# EAGLE design rev_c (EAGLE 9.6.2)
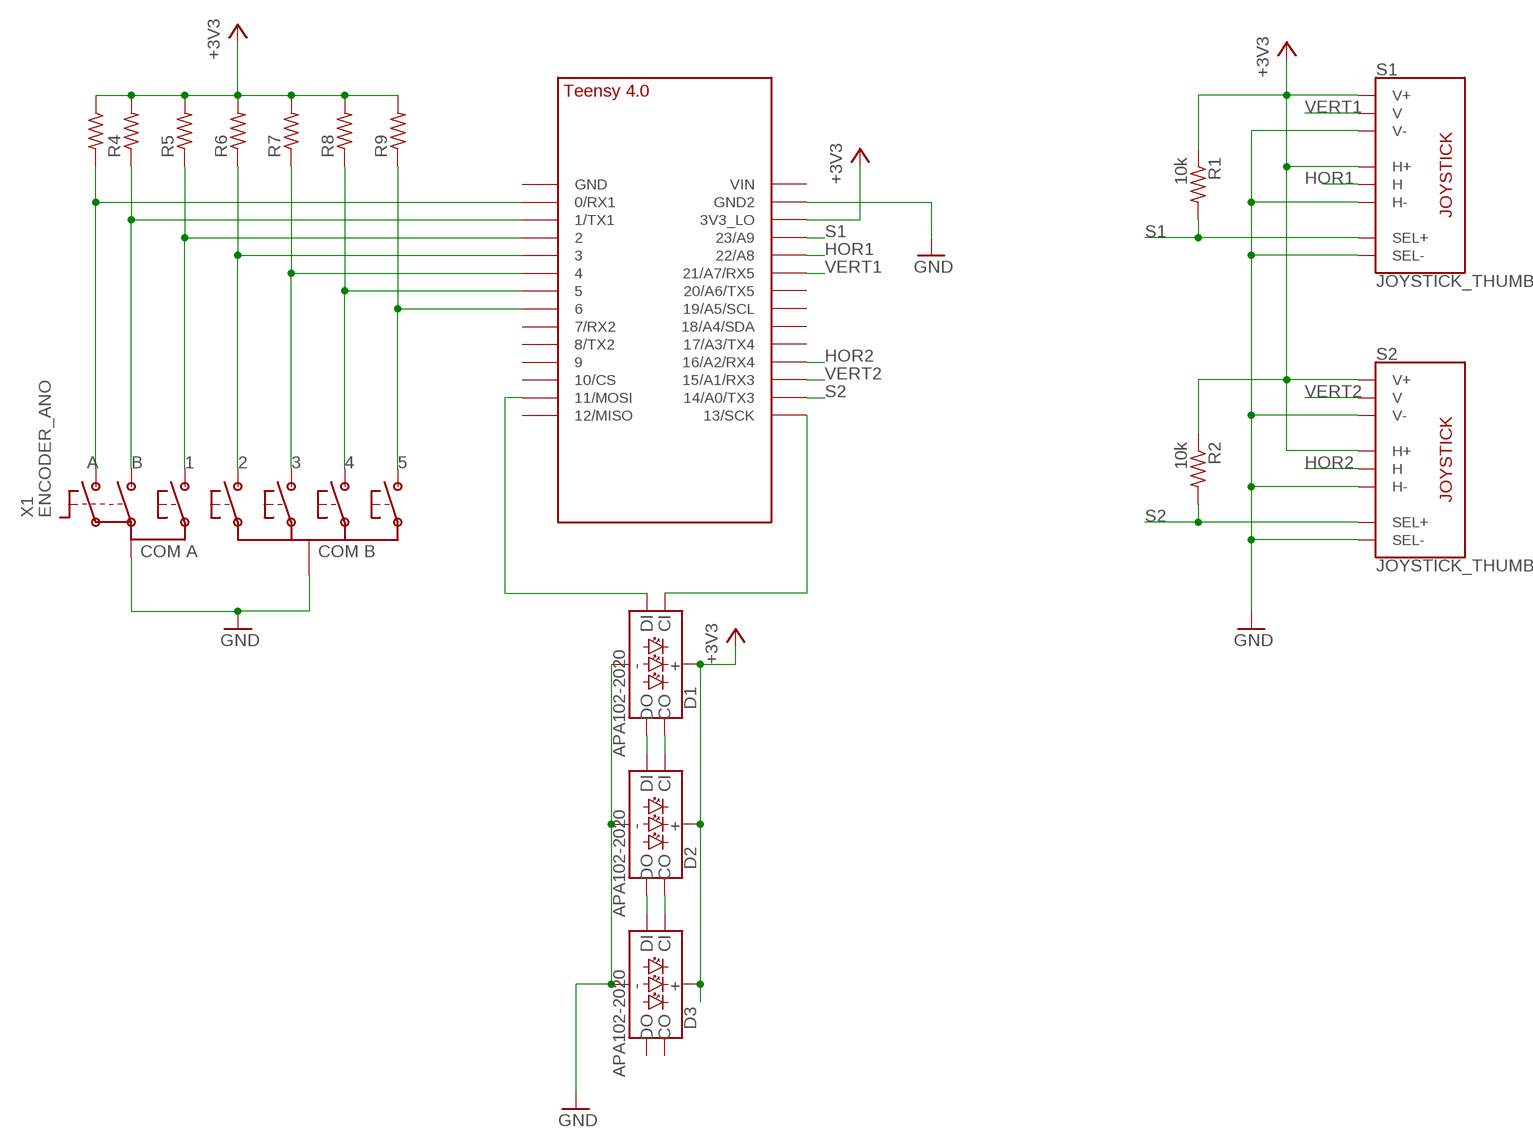
[diagram p0: schematic, sheet 1]

## Parts
D1  APA102-2020  [APA102-2020]
D2  APA102-2020  [APA102-2020]
D3  APA102-2020  [APA102-2020]
MCU  TEENSY_4.0-NOBOTTOM  [TEENSY_4.0-NOBOTTOM]
R1  10k  R-US_R0603  [R0603]
R2  10k  R-US_R0603  [R0603]
R3  10k  R-US_R0603  [R0603]
R4  R-US_R0603  [R0603]
R5  R-US_R0603  [R0603]
R6  R-US_R0603  [R0603]
R7  R-US_R0603  [R0603]
R8  R-US_R0603  [R0603]
R9  R-US_R0603  [R0603]
S1  JOYSTICK_THUMB  [JOYSTICK]
S2  JOYSTICK_THUMB  [JOYSTICK]
X1  ENCODER_ANO  [ENCODER_ANO]

## Nets
+3V3: D1.VDD(VCC) D2.VDD(VCC) D3.VDD(VCC) MCU.3V3_LO R1.1 R2.1 R3.1 R4.2 R5.2 R6.2 R7.2 R8.2 R9.2 S1.H1(H+) S1.V1(V+) S2.H1(H+) S2.V1(V+)
GND: D1.GND D2.GND D3.GND MCU.GND2 S1.B2A(SEL-) S1.H3(H-) S1.V3(V-) S2.B2A(SEL-) S2.H3(H-) S2.V3(V-) X1.COM_A(COMA) X1.COM_B
HOR1: MCU.22/A8 S1.H2(H)
HOR2: MCU.16/A2(16/A2/RX4) S2.H2(H)
N$1: MCU.6 R9.1 X1.S5
N$2: MCU.5 R8.1 X1.S4
N$3: MCU.4/CANRX R7.1 X1.S3
N$4: MCU.3/CANTX R6.1 X1.S2
N$5: MCU.2 R5.1 X1.S1
N$6: MCU.1/TX(1/TX1) R4.1 X1.B
N$7: MCU.0/RX(0/RX1) R3.2 X1.A
N$8: D1.SDO(DO) D2.SDI(DI)
N$9: D1.CKO(CO) D2.CKI(CI)
N$10: D2.SDO(DO) D3.SDI(DI)
N$11: D2.CKO(CO) D3.CKI(CI)
N$12: D1.CKI(CI) MCU.13/SCK
N$13: D1.SDI(DI) MCU.11/MOSI
S1: MCU.23/A9 R1.2 S1.B1A(SEL+)
S2: MCU.14/A0(14/A0/TX3) R2.2 S2.B1A(SEL+)
VERT1: MCU.21/A7(21/A7/RX5) S1.V2(V)
VERT2: MCU.15/A1(15/A1/RX3) S2.V2(V)
Unconnected: D3.CKO(CO) D3.SDO(DO) MCU.7(7/RX2) MCU.8(8/TX2) MCU.9/CS MCU.10/CS MCU.12/MISO MCU.17/A3(17/A3/TX4) MCU.18/A4/SDA MCU.19/A5/SCL MCU.20/A6(20/A6/TX5) MCU.GND MCU.VIN

## Library data of the parts
D1-D3 = SparkFun-LED:APA102: Addressable RGB LED - 2 Wire Common names: APA102, Dotstar, etc. Packages: 5050 2020 SparkFun Products: SparkFun Lumenati Boards <https://www.sparkfun.com/categories/405>; PROD_ID: DIO-14111
MCU = Teensy-4.0:TEENSY_4.0-NOBOTTOM
R1-R9 = adafruit:R-US_: RESISTOR, American symbol
S1 S2 = SparkFun-Switches:JOYSTICK_THUMB: Analog Thumb Joystick This is a joystick very similar to the ‘analog’ joysticks on PS2 (PlayStation 2) controllers. Directional movements are simply two potentiometers - one for each axis. Pots are ~10k each. This joystick also has a select button that is actuated when the joystick is pressed down. SparkFun Products Thumb Joystick <https://www.sparkfun.com/products/9032> (COM-09032) SparkFun Thumb Joystick Breakout <https://www.sparkfun.com/products/9110> (BOB-09110) SparkFun Joystick Shield Kit <https://www.sparkfun.com/products/9760> (DEV-09760); PROD_ID: COMP-09744; SF_SKU: COM-09032
X1 = custom:ENCODER_ANO

## Net classes
0 default: width 0.127 mm

## Board
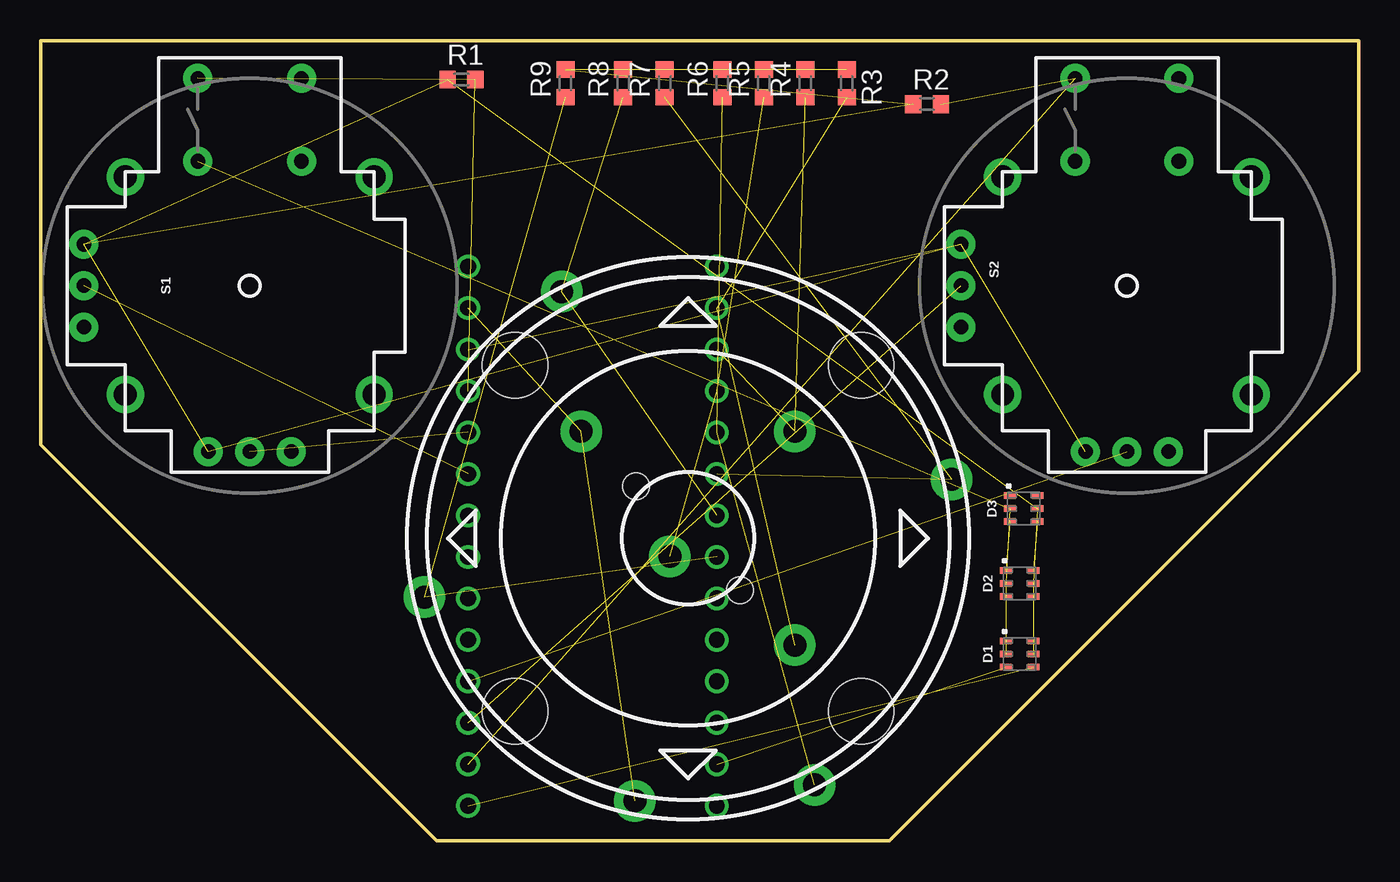
[diagram p1: board, top side]
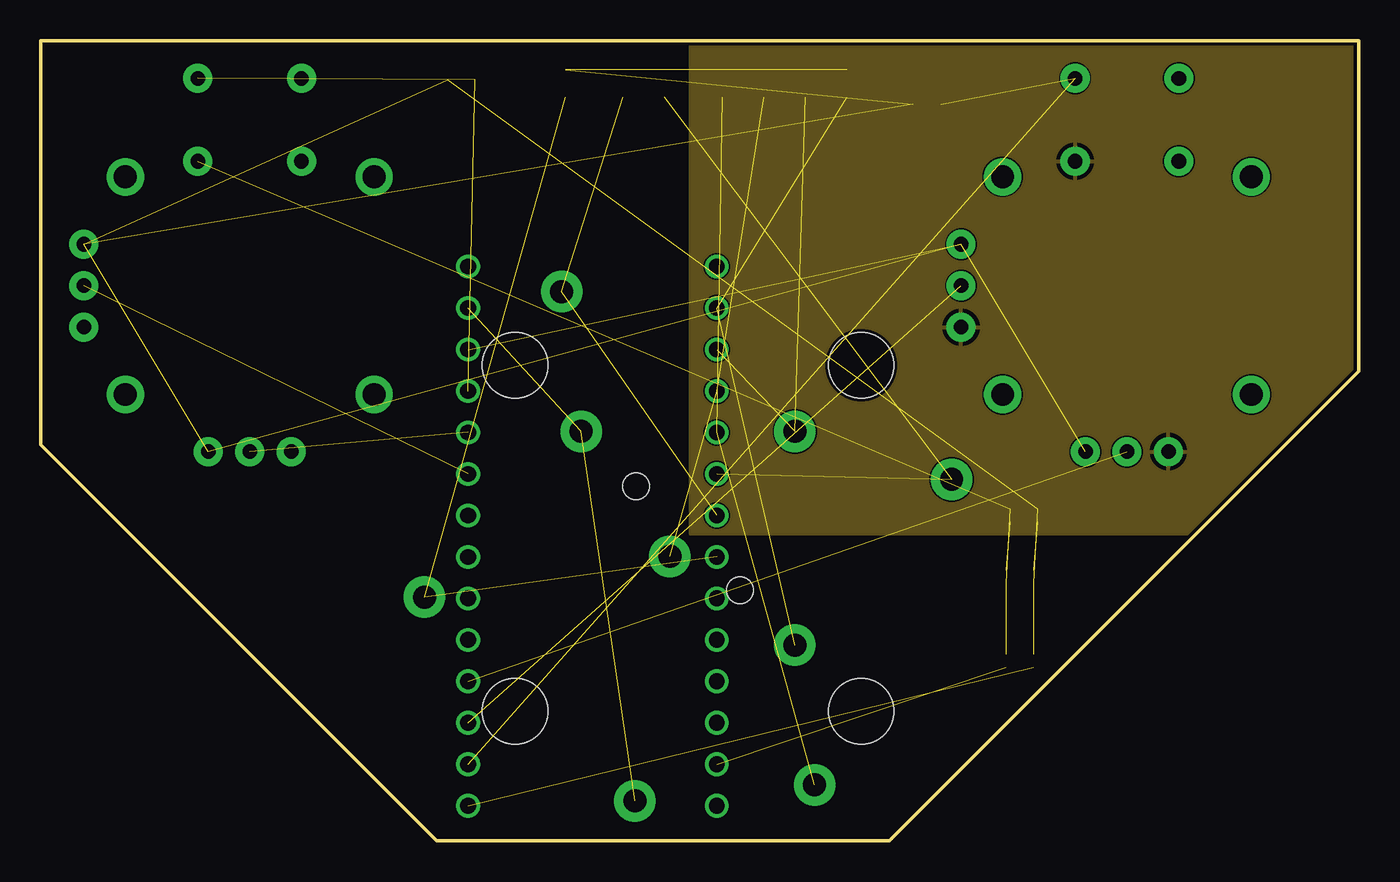
[diagram p2: board, inner layer Route2]
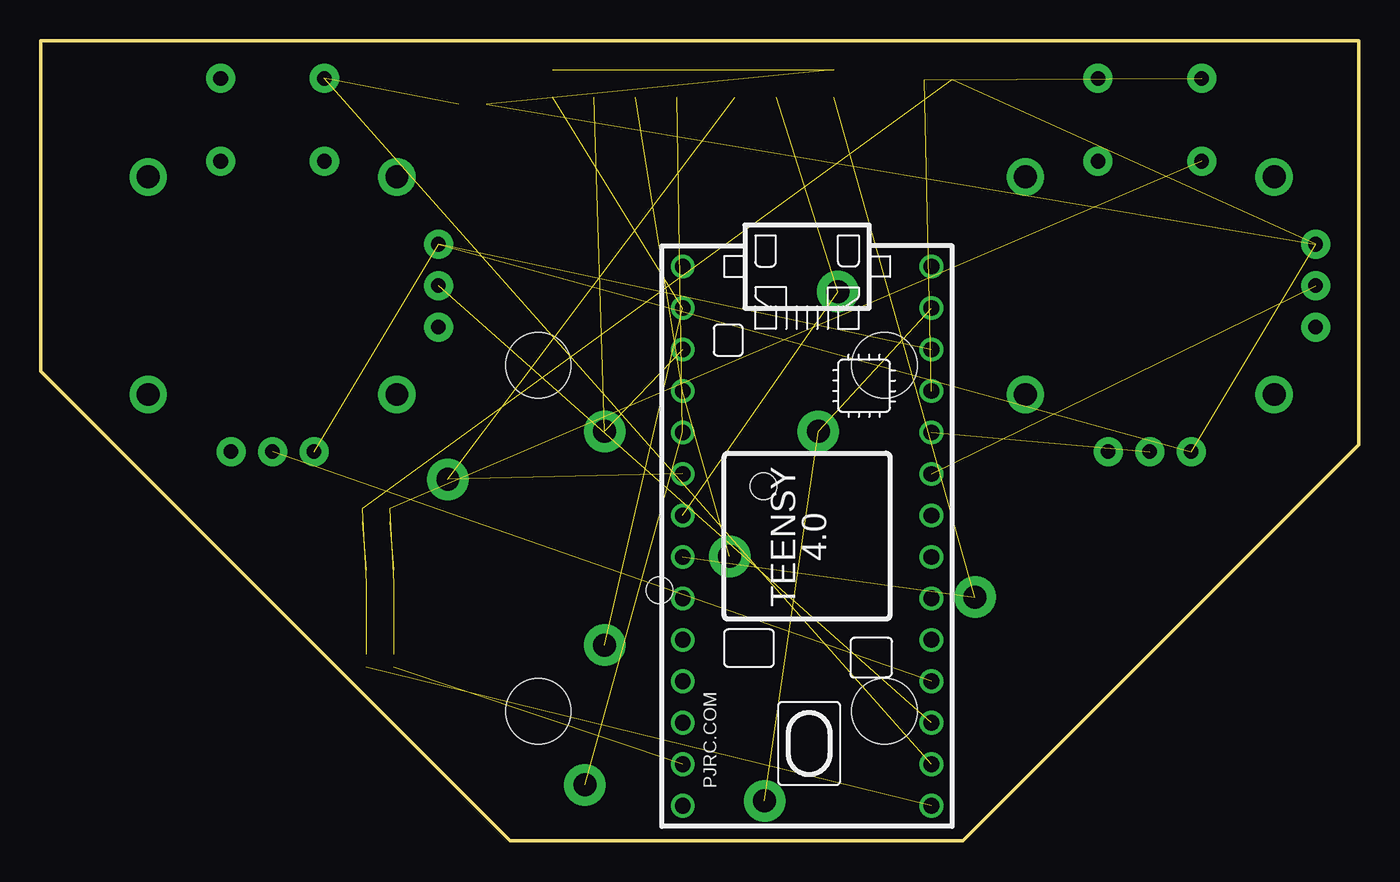
[diagram p3: board, bottom side, seen from below]

Size 80.75 x 49 mm. Coordinates in mm from the lower left corner, seen from the top.
Outline: 0,49 0,24.25 24.25,0 52,0 80.75,28.75 80.75,49 0,49
Copper layers (1+2*15+16): Top 0.035mm / dielectric 0.2mm / Route2 0.035mm / dielectric 0.15mm / Route15 0.035mm / dielectric 0.2mm / Bottom 0.035mm
Design rules "jlcpcb": minimum track width 3.5mil, minimum drill 0.2mm, track to track 3.5mil, track to pad 0.2mm, pad to pad 5mil, via to via 10mil, smd to smd 5mil, copper to edge 0.2mm, drill to drill 0.5mm, minimum pad ring 0.13mm, minimum via ring 0.13mm, stop-mask expansion 4mil, vias tented up to drill 0mil, thermal gap 10mil

### Footprints (pad centres in the part's own frame; a part is rotated, then mirrored left to right if it is on the bottom)
APA102-2020 = smd 0.4 x 0.7: CKI -0.8,-0.85; CKO 0.8,-0.85; GND 0,0.85; SDI -0.8,0.85; SDO 0.8,0.85; VDD 0,-0.85
TEENSY_4.0-NOBOTTOM = drill 0.965: 0/RX -13.97,-7.62; 1/TX -11.43,-7.62; 2 -8.89,-7.62; 3/CANTX -6.35,-7.62; 3V3_LO -11.43,7.62; 4/CANRX -3.81,-7.62; 5 -1.27,-7.62; 6 1.27,-7.62; 7 3.81,-7.62; 8 6.35,-7.62; 9/CS 8.89,-7.62; 10/CS 11.43,-7.62; 11/MOSI 13.97,-7.62; 12/MISO 16.51,-7.62; 13/SCK 16.51,7.62; 14/A0 13.97,7.62; 15/A1 11.43,7.62; 16/A2 8.89,7.62; 17/A3 6.35,7.62; 18/A4/SDA 3.81,7.62; 19/A5/SCL 1.27,7.62; 20/A6 -1.27,7.62; 21/A7 -3.81,7.62; 22/A8 -6.35,7.62; 23/A9 -8.89,7.62; GND -16.51,-7.62; GND2 -13.97,7.62; VIN -16.51,7.62
R0603 = smd 1 x 1.1: 1 -0.85,0; 2 0.85,0
JOYSTICK = drill 0.9 pad 1.778: B1A -3.175,12.7; B1B 3.175,12.7; B2A -3.175,7.62; B2B 3.175,7.62 | drill 0.889 pad 1.778: H1 -2.54,-10.16; H2 0,-10.16; H3 2.54,-10.16; V1 -10.16,2.54; V2 -10.16,0; V3 -10.16,-2.54 | drill 1.397 pad 2.286: MOUNT1 -7.62,6.668; MOUNT2 -7.62,-6.668; MOUNT3 7.62,-6.668; MOUNT4 7.62,6.668
ENCODER_ANO = drill 1.4 pad 2.54: A 0,-9.26; B 9.26,0; COM_A 0,9.26; COM_B -13.67,-9.07; S1 -1.57,0; S2 -5.2,-16.16; S3 13.97,-8.87; S4 5.2,16.16; S5 -13.97,8.87 | hole 1.6: 0,4.5; 0,-4.5 | hole 4: 0,15; 0,-15; -15,0; 15,0

### Placement (x,y rotation side)
D1  59.97,11.44 90 top
D2  59.97,15.77 90 top
D3  60.22,20.35 90 top
MCU  33.8,18.66 270 bottom
R1  25.77,46.63 0 top
R2  54.3,45.12 0 top
R3  49.38,46.39 270 top
R4  46.84,46.39 90 top
R5  44.3,46.39 90 top
R6  41.76,46.39 90 top
R7  38.22,46.39 90 top
R8  35.68,46.39 90 top
R9  32.14,46.39 90 top
S1  12.8,34 0 top
S2  66.55,34 0 top
X1  39.66,18.53 45 top

### Tracks (layer width: path | path; a pad name or v marks a point on that pad's centre or on a via)
+3V3  (16 unrouted)
GND  (5 unrouted)
  pour Route2: 39.75,90.75 39.75,18.75 100.75,18.75 100.75,90.75
HOR1  (1 unrouted)
HOR2  (1 unrouted)
N$1  (2 unrouted)
N$2  (2 unrouted)
N$3  (2 unrouted)
N$4  (2 unrouted)
N$5  (2 unrouted)
N$6  (2 unrouted)
N$7  (2 unrouted)
N$8  (1 unrouted)
N$9  (1 unrouted)
N$10  (1 unrouted)
N$11  (1 unrouted)
N$12  (1 unrouted)
N$13  (1 unrouted)
S1  (2 unrouted)
S2  (2 unrouted)
VERT1  (1 unrouted)
VERT2  (1 unrouted)